# Altium project Prj_machcambienHall_v1.PrjPcb
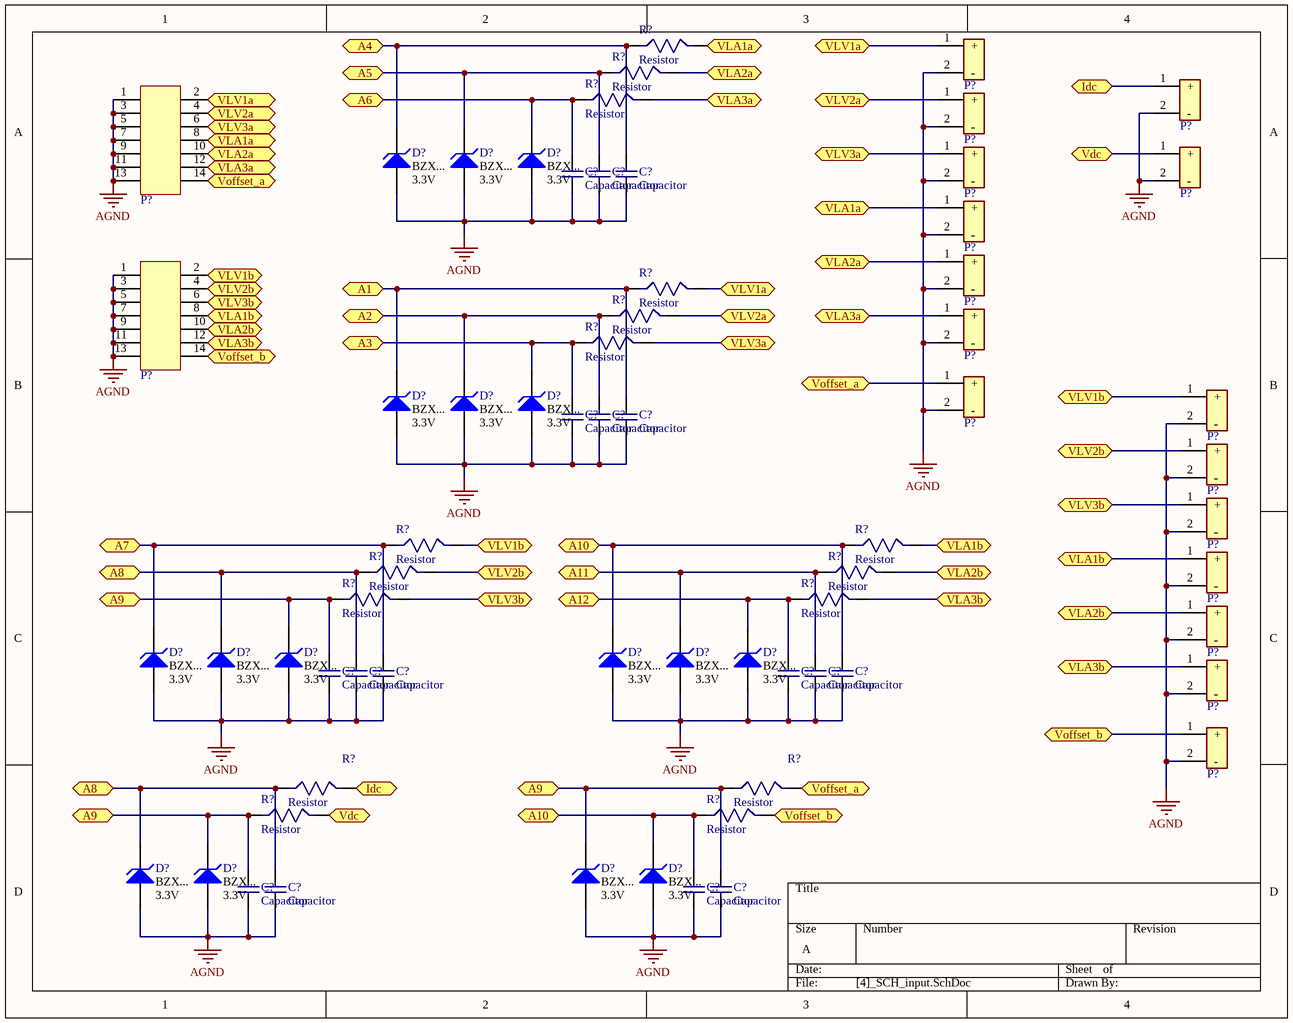
[diagram p0: [4]_SCH_input.SchDoc]
5 sheets, 283 parts. Net scope: flat (ports and power ports of the same name join across sheets).
Board files: PCB_machcambienHall.PcbDoc, PCB_mcbHallV2.PcbDoc, PCB_mcbHallV3.PcbDoc
Sheets:
  [4]_SCH_input.SchDoc
  SCH_power.SchDoc
  SCH_HallcurrentLA25p.SchDoc
  SCH_HallVoltageLV25np.SchDoc
  SCH_Output.SchDoc

## Sheet [4]_SCH_input.SchDoc
size A

### Parts
(Parts that share a designator on the sheet are numbered #1, #2 ... from top to bottom, then left to right.)
C?#1  Capacitor  [C-NP-0805]
C?#2  Capacitor  [C-NP-0805]
C?#3  Capacitor  [C-NP-0805]
C?#4  Capacitor  [C-NP-0805]
C?#5  Capacitor  [C-NP-0805]
C?#6  Capacitor  [C-NP-0805]
C?#7  Capacitor  [C-NP-0805]
C?#8  Capacitor  [C-NP-0805]
C?#9  Capacitor  [C-NP-0805]
C?#10  Capacitor  [C-NP-0805]
C?#11  Capacitor  [C-NP-0805]
C?#12  Capacitor  [C-NP-0805]
C?#13  Capacitor  [C-NP-0805]
C?#14  Capacitor  [C-NP-0805]
C?#15  Capacitor  [C-NP-0805]
C?#16  Capacitor  [C-NP-0805]
D?#1  value BZX...  Volt: 3.3V  [DO_123]  (hidden comment: Diode Zener)
D?#2  value BZX...  Volt: 3.3V  [DO_123]  (hidden comment: Diode Zener)
D?#3  value BZX...  Volt: 3.3V  [DO_123]  (hidden comment: Diode Zener)
D?#4  value BZX...  Volt: 3.3V  [DO_123]  (hidden comment: Diode Zener)
D?#5  value BZX...  Volt: 3.3V  [DO_123]  (hidden comment: Diode Zener)
D?#6  value BZX...  Volt: 3.3V  [DO_123]  (hidden comment: Diode Zener)
D?#7  value BZX...  Volt: 3.3V  [DO_123]  (hidden comment: Diode Zener)
D?#8  value BZX...  Volt: 3.3V  [DO_123]  (hidden comment: Diode Zener)
D?#9  value BZX...  Volt: 3.3V  [DO_123]  (hidden comment: Diode Zener)
D?#10  value BZX...  Volt: 3.3V  [DO_123]  (hidden comment: Diode Zener)
D?#11  value BZX...  Volt: 3.3V  [DO_123]  (hidden comment: Diode Zener)
D?#12  value BZX...  Volt: 3.3V  [DO_123]  (hidden comment: Diode Zener)
D?#13  value BZX...  Volt: 3.3V  [DO_123]  (hidden comment: Diode Zener)
D?#14  value BZX...  Volt: 3.3V  [DO_123]  (hidden comment: Diode Zener)
D?#15  value BZX...  Volt: 3.3V  [DO_123]  (hidden comment: Diode Zener)
D?#16  value BZX...  Volt: 3.3V  [DO_123]  (hidden comment: Diode Zener)
P?#1  SMA  [SMA]  (value not drawn)
P?#2  SMA  [SMA]  (value not drawn)
P?#3  header_2x7  [hd_2x7]  (value not drawn)
P?#4  SMA  [SMA]  (value not drawn)
P?#5  SMA  [SMA]  (value not drawn)
P?#6  SMA  [SMA]  (value not drawn)
P?#7  SMA  [SMA]  (value not drawn)
P?#8  SMA  [SMA]  (value not drawn)
P?#9  header_2x7  [hd_2x7]  (value not drawn)
P?#10  SMA  [SMA]  (value not drawn)
P?#11  SMA  [SMA]  (value not drawn)
P?#12  SMA  [SMA]  (value not drawn)
P?#13  SMA  [SMA]  (value not drawn)
P?#14  SMA  [SMA]  (value not drawn)
P?#15  SMA  [SMA]  (value not drawn)
P?#16  SMA  [SMA]  (value not drawn)
P?#17  SMA  [SMA]  (value not drawn)
P?#18  SMA  [SMA]  (value not drawn)
R?#1  Resistor  [RESC0805]
R?#2  Resistor  [RESC0805]
R?#3  Resistor  [RESC0805]
R?#4  Resistor  [RESC0805]
R?#5  Resistor  [RESC0805]
R?#6  Resistor  [RESC0805]
R?#7  Resistor  [RESC0805]
R?#8  Resistor  [RESC0805]
R?#9  Resistor  [RESC0805]
R?#10  Resistor  [RESC0805]
R?#11  Resistor  [RESC0805]
R?#12  Resistor  [RESC0805]
R?#13  Resistor  [RESC0805]
R?#14  Resistor  [RESC0805]
R?#15  Resistor  [RESC0805]
R?#16  Resistor  [RESC0805]

### Ports
A1, A2, A3, A4, A5, A6, A7, A8, A9, A10, A11, A12, Idc, Vdc, VLA1a, VLA1b, VLA2a, VLA2b, VLA3a, VLA3b, VLV1a, VLV1b, VLV2a, VLV2b, VLV3a, VLV3b, Voffset_a, Voffset_b

### Nets
AGND: C?#1.1 C?#2.1 C?#3.1 C?#4.1 C?#5.1 C?#6.1 C?#7.1 C?#8.1 C?#9.1 C?#10.1 C?#11.1 C?#12.1 C?#13.1 C?#14.1 C?#15.1 C?#16.1 D?#1.1(A) D?#2.1(A) D?#3.1(A) D?#4.1(A) D?#5.1(A) D?#6.1(A) D?#7.1(A) D?#8.1(A) D?#9.1(A) D?#10.1(A) D?#11.1(A) D?#12.1(A) D?#13.1(A) D?#14.1(A) D?#15.1(A) D?#16.1(A) P?#1.2(-) P?#2.2(-) P?#3.1 P?#3.3 P?#3.5 P?#3.7 P?#3.9 P?#3.11 P?#3.13 P?#4.2(-) P?#5.2(-) P?#6.2(-) P?#7.2(-) P?#8.2(-) P?#9.1 P?#9.3 P?#9.5 P?#9.7 P?#9.9 P?#9.11 P?#9.13 P?#10.2(-) P?#11.2(-) P?#12.2(-) P?#13.2(-) P?#14.2(-) P?#15.2(-) P?#16.2(-) P?#17.2(-) P?#18.2(-)
NetC?#1_2: C?#1.2 D?#3.2(K) R?#3.1 ; port A6
NetC?#2_2: C?#2.2 D?#2.2(K) R?#2.1 ; port A5
NetC?#3_2: C?#3.2 D?#1.2(K) R?#1.1 ; port A4
NetC?#4_2: C?#4.2 D?#6.2(K) R?#6.1 ; port A3
NetC?#5_2: C?#5.2 D?#5.2(K) R?#5.1 ; port A2
NetC?#6_2: C?#6.2 D?#4.2(K) R?#4.1 ; port A1
NetC?#7_2: C?#7.2 C?#13.2 C?#16.2 D?#9.2(K) D?#14.2(K) D?#15.2(K) R?#11.1 R?#14.1 R?#15.1 ; port A9
NetC?#8_2: C?#8.2 C?#14.2 D?#8.2(K) D?#13.2(K) R?#9.1 R?#13.1 ; port A8
NetC?#9_2: C?#9.2 D?#7.2(K) R?#7.1 ; port A7
NetC?#10_2: C?#10.2 D?#12.2(K) R?#12.1 ; port A12
NetC?#11_2: C?#11.2 D?#11.2(K) R?#10.1 ; port A11
NetC?#12_2: C?#12.2 C?#15.2 D?#10.2(K) D?#16.2(K) R?#8.1 R?#16.1 ; port A10
NetP?#1_1: P?#1.1(+) P?#3.2 R?#4.2 ; port VLV1a
NetP?#2_1: P?#2.1(+) R?#13.2 ; port Idc
NetP?#3_4: P?#3.4 P?#4.1(+) R?#5.2 ; port VLV2a
NetP?#3_6: P?#3.6 P?#5.1(+) R?#6.2 ; port VLV3a
NetP?#3_8: P?#3.8 P?#7.1(+) R?#1.2 ; port VLA1a
NetP?#3_10: P?#3.10 P?#8.1(+) R?#2.2 ; port VLA2a
NetP?#3_12: P?#3.12 P?#10.1(+) R?#3.2 ; port VLA3a
NetP?#3_14: P?#3.14 P?#11.1(+) R?#14.2 ; port Voffset_a
NetP?#6_1: P?#6.1(+) R?#15.2 ; port Vdc
NetP?#9_2: P?#9.2 P?#12.1(+) R?#7.2 ; port VLV1b
NetP?#9_4: P?#9.4 P?#13.1(+) R?#9.2 ; port VLV2b
NetP?#9_6: P?#9.6 P?#14.1(+) R?#11.2 ; port VLV3b
NetP?#9_8: P?#9.8 P?#15.1(+) R?#8.2 ; port VLA1b
NetP?#9_10: P?#9.10 P?#16.1(+) R?#10.2 ; port VLA2b
NetP?#9_12: P?#9.12 P?#17.1(+) R?#12.2 ; port VLA3b
NetP?#9_14: P?#9.14 P?#18.1(+) R?#16.2 ; port Voffset_b

### Library data of the parts
C?#1-C?#16 = capacitor_non_polar: capacitor non polar
D?#1-D?#16 = Diode Zener: Zener Diode; Vendor: Digikey; Published: 8-Jun-2000; LatestRevisionDate: 17-Jul-2002; LatestRevisionNote: Re-released for DXP Platform.; PackageReference: DIODE-0.7; Publisher: Altium Limited; ComponentLink1Description: Digikey Part Link; ComponentLink2Description: Open Datasheet; ComponentLink2URL: H:\LIBRARY\LIBRARY.Datasheet\
P?#1 P?#2 P?#4-P?#8 P?#10-P?#18 = SMA 13,5
P?#3 P?#9 = header_2x7pin

## Sheet SCH_power.SchDoc
size A; DocumentNumber: 1; SheetNumber: 1; SheetTotal: 4
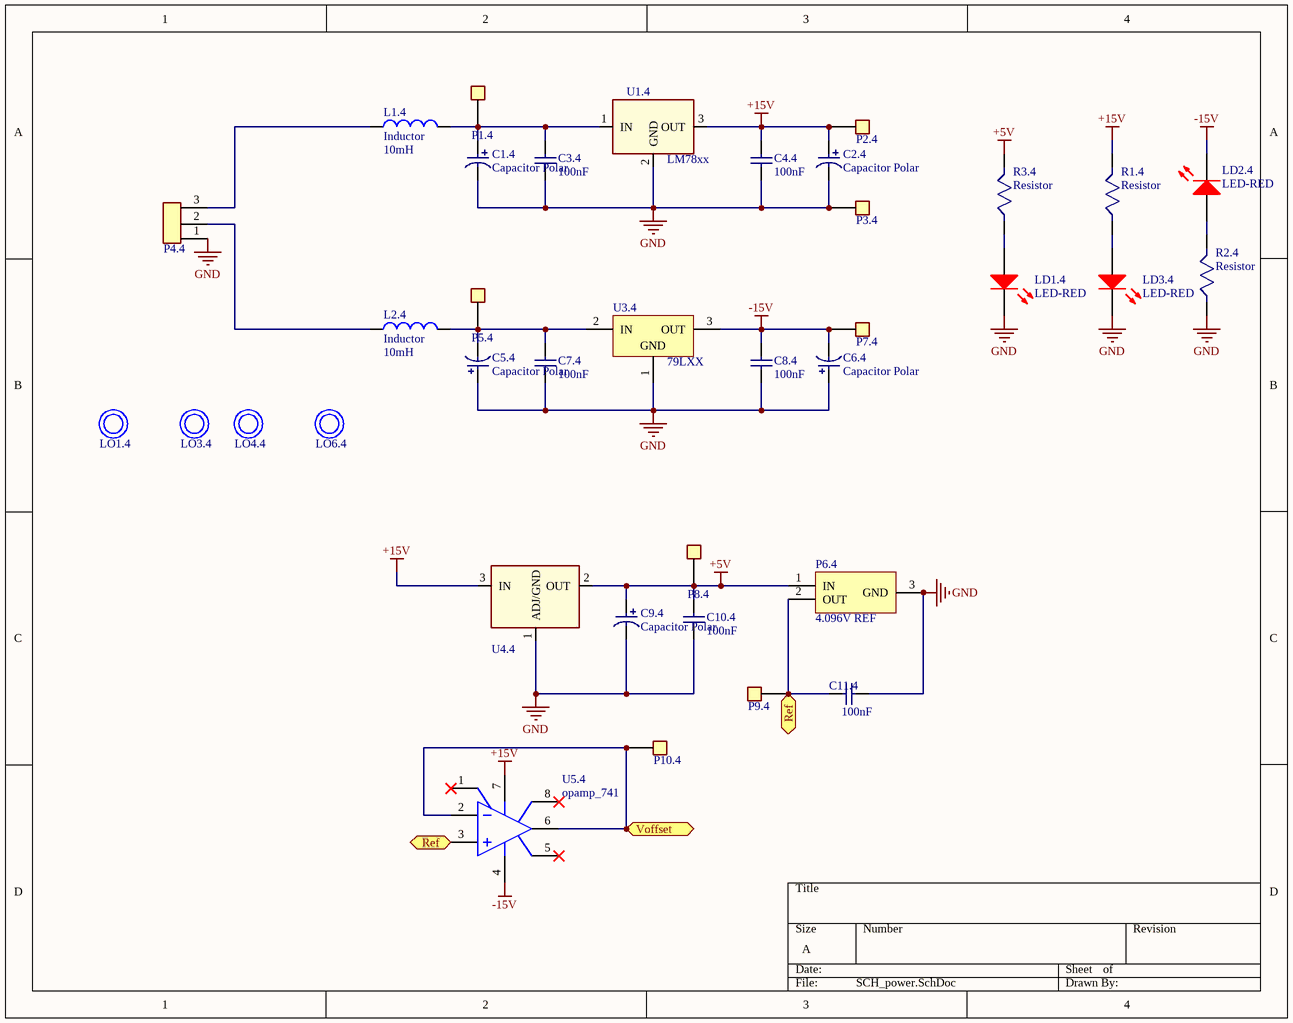
[diagram p1: SCH_power.SchDoc]

### Parts
C1.4  Capacitor Polar  [CAP_SMD_L=10.5]
C2.4  Capacitor Polar  [CAP_SMD_L=10.5]
C3.4  100nF  [C-NP-0805]
C4.4  100nF  [C-NP-0805]
C5.4  Capacitor Polar  [CAP_SMD_L=10.5]
C6.4  Capacitor Polar  [CAP_SMD_L=10.5]
C7.4  100nF  [C-NP-0805]
C8.4  100nF  [C-NP-0805]
C9.4  Capacitor Polar  [CAP_SMD_L=10.5]
C10.4  100nF  [C-NP-0805]
C11.4  100nF  [C-NP-0805]
L1.4  Inductor  value 10mH  [induction_coil]
L2.4  Inductor  value 10mH  [induction_coil]
LD1.4  LED-RED  [SMD 1206 RED]
LD2.4  LED-RED  [SMD 1206 RED]
LD3.4  LED-RED  [SMD 1206 RED]
LO1.4  LO KHOAN  [SP PCB]  (value not drawn)
LO3.4  LO KHOAN  [SP PCB]  (value not drawn)
LO4.4  LO KHOAN  [SP PCB]  (value not drawn)
LO6.4  LO KHOAN  [SP PCB]  (value not drawn)
P1.4  testpin  [tp_red_1p]  (value not drawn)
P2.4  testpin  [tp_red_1p]  (value not drawn)
P3.4  testpin  [Tp_black_1p]  (value not drawn)
P4.4  domino_3p  [domino_3p]  (value not drawn)
P5.4  testpin  [tp_red_1p]  (value not drawn)
P6.4  4.096V REF  [SOT233]
P7.4  testpin  [tp_red_1p]  (value not drawn)
P8.4  testpin  [tp_red_1p]  (value not drawn)
P9.4  testpin  [tp_red_1p]  (value not drawn)
P10.4  testpin  [tp_red_1p]  (value not drawn)
R1.4  Resistor  [RESC0805]
R2.4  Resistor  [RESC0805]
R3.4  Resistor  [RESC0805]
U1.4  LM78xx  [TO 220 THermal 25x25]
U3.4  79LXX  [TO 220 THermal 25x25]
U4.4  LM1117MP-3.3TR  [AMS1117]  (value not drawn)
U5.4  opamp_741  [SOIC-8_dan]

### Ports
Ref, Voffset

### Nets
+5V: C9.4.1 C10.4.1 P6.4.1(IN) P8.4.1 R3.4.2 U4.4.2(OUT)
+15V: C2.4.1 C4.4.1 P2.4.1 R1.4.2 U1.4.3(OUT) U4.4.3(IN) U5.4.7(V+)
-15V: C6.4.2 C8.4.1 LD2.4.2(K) P7.4.1 U3.4.3(OUT) U5.4.4(V-)
GND: C1.4.2 C2.4.2 C3.4.2 C4.4.2 C5.4.1 C6.4.1 C7.4.2 C8.4.2 C9.4.2 C10.4.2 C11.4.1 LD1.4.2(K) LD3.4.2(K) P3.4.1 P4.4.1 P6.4.3(GND) R2.4.1 U1.4.2(GND) U3.4.1(GND) U4.4.1(ADJ/GND)
NetC1.4_1: C1.4.1 C3.4.1 L1.4.2 P1.4.1 U1.4.1(IN)
NetC5.4_2: C5.4.2 C7.4.1 L2.4.2 P5.4.1 U3.4.2(IN)
NetC11.4_2: C11.4.2 P6.4.2(OUT) P9.4.1 U5.4.3(IN+) ; port Ref
NetL1.4_1: L1.4.1 P4.4.3
NetL2.4_1: L2.4.1 P4.4.2
NetLD1.4_1: LD1.4.1(A) R3.4.1
NetLD2.4_1: LD2.4.1(A) R2.4.2
NetLD3.4_1: LD3.4.1(A) R1.4.1
NetP2.3_13: P10.4.1 U5.4.2(IN-) U5.4.6(OUT) ; port Voffset

Not connected (* = marked no-connect by the designer): U5.4 1(VOSTRIM)* 5(NC)* 8(VOSTRIM)*

### Library data of the parts
C1.4 C2.4 C5.4 C6.4 C9.4 = capacitor_polar 6.3x11mm
C3.4 C4.4 C7.4 C8.4 C10.4 C11.4 = capacitor_non_polar: capacitor non polar
L1.4 L2.4 = Inductor: Code_IEC: 1005; Published: 8-Jun-2000; LatestRevisionDate: 29-May-2009; LatestRevisionNote: IPC-7351 Footprint Added.; PackageReference: 0402-A; Publisher: Altium Limited; PackageDescription: Chip Inductor; Code_JEITA: 0402
LD1.4 LD2.4 LD3.4 = LED_LTST-C191KRKT: LED RED CLEAR 0603 SMD; Manufacturer: Lite-On Inc.; Lens Color: Colorless; Millicandela Rating: 54mcd; Lens Style/Size: Rectangle with Flat Top, 1.10mm x 0.80mm; Voltage - Forward (Vf) (Typ): 2V; Current - Test: 20mA; Viewing Angle: 130°; Wavelength - Dominant: 631nm; Wavelength - Peak: 639nm; Supplier 1: Digi-Key; Manufacturer Part Number: LTST-C191KRKT; RoHS: RoHS Compliant; Category: Optoelectronics; Stock 1: 711347; Pricing 1: 1=0.29, 10=0.211, 25=0.1556, 100=0.1111, 250=0.07556, 500=0.06666, 1000=0.05222, 2500=0.05111 (USD); Packaging: Digi-Reel®; Part Status: Active; Color: Red; Lens Transparency: Clear; Mounting Type: Surface Mount; Features: -; Size / Dimension: 1.60mm L x 0.80mm W; Height (Max): 0.65mm; ComponentLink1URL: http://optoelectronics.liteon.com/upload/download/DS22-2000-223/LTST-C191KRKT.PDF; ComponentLink1Description: http://optoelectronics.liteon.com/upload/download/DS22-2000-223/LTST-C191KRKT.PDF; Supplier Part Number 1: 160-1447-6-ND; Package / Case: 0603 (1608 Metric)
P6.4 = MCP1541T
U1.4 = LM78xx: Regulator; Manufacturer: Fairchild Semiconductor Corporation; PSpiceTemplate: X^@REFDES %IN %OUT %GND @MODEL; Vendor: Digikey; Output Current: Up to 1A; V out: 5V; Tolerance: 4 %; Value: LM7805CT; Published: 13-April-2009; Publisher: Hoang Nguyen; ComponentLink1Description: Digikey Part Link; ComponentLink2Description: Open Datasheet; ComponentLink2URL: H:\LIBRARY\LIBRARY.Datasheet\LM7805.pdf; Price: 2500 VND
U3.4 = LM79LXX: 3-Terminal Negative Regulator; Published: 15-Apr-2002; DatasheetVersion: Jul-1999; PackageVersion: 2000; PackageReference: Z03A; Publisher: Altium Limited; PackageDescription: TO, Flat Index; 3 In-Line, Axial Leads; Body Dia. 4.6mm; Leads 0.53 x 0.39 mm (max); ComponentLink1Description: Manufacturer Link; ComponentLink1URL: http://www.national.com/; ComponentLink2Description: Datasheet; ComponentLink2URL: http://www.national.com/ds.cgi/LM/LM320L.pdf; ComponentLink3Description: URL Link1; ComponentLink3URL: http://www.national.com/pf/LM/LM79L05.html
U4.4 = LM1117MP-3.3TR: 3.3V 800mA Low-Dropout Linear Regulator; PSpiceTemplate: X^@REFDES %IN %OUT %GND @MODEL; Vendor: Digikey; Volt (Max): 20V; Publisher: Hoang Nguyen; ComponentLink1URL: http://search.digikey.com/scripts/DkSearch/dksus.dll?Detail&name=LM1117MP-3.3TR-ND; ComponentLink1Description: Digikey Part Link; ComponentLink2Description: Open Datasheet; ComponentLink2URL: H:\LIBRARY\LIBRARY.Datasheet\LM1117.pdf; Published: 13-April-2009; V out: 3.3V; Output Current (max): 800mA; Price: 4.000 VND
U5.4 = opamp 741

## Sheet SCH_HallcurrentLA25p.SchDoc
size A; DocumentNumber: 2; SheetNumber: 2; SheetTotal: 4
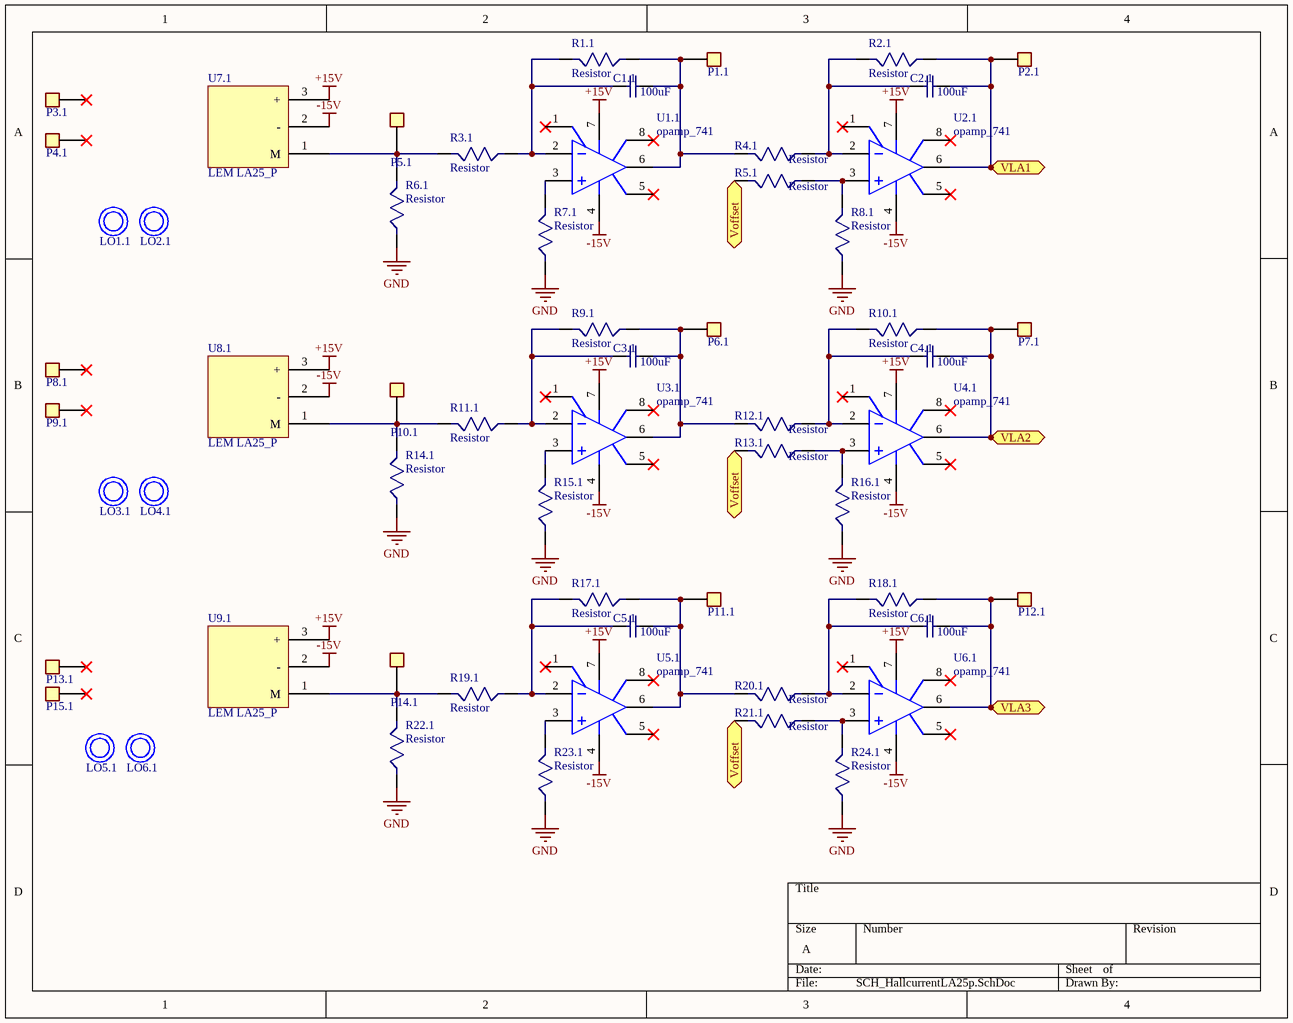
[diagram p2: SCH_HallcurrentLA25p.SchDoc]

### Parts
C1.1  100uF  [CAPC0805]
C2.1  100uF  [CAPC0805]
C3.1  100uF  [CAPC0805]
C4.1  100uF  [CAPC0805]
C5.1  100uF  [CAPC0805]
C6.1  100uF  [CAPC0805]
LO1.1  LO KHOAN  [Lo Khoang - 6mm]  (value not drawn)
LO2.1  LO KHOAN  [Lo Khoang - 6mm]  (value not drawn)
LO3.1  LO KHOAN  [Lo Khoang - 6mm]  (value not drawn)
LO4.1  LO KHOAN  [Lo Khoang - 6mm]  (value not drawn)
LO5.1  LO KHOAN  [Lo Khoang - 6mm]  (value not drawn)
LO6.1  LO KHOAN  [Lo Khoang - 6mm]  (value not drawn)
P1.1  testpin  [Tp_blue_1p]  (value not drawn)
P2.1  testpin  [Tp_blue_1p]  (value not drawn)
P3.1  Terminal on PCB  [Terminal M5]  (value not drawn)
P4.1  Terminal on PCB  [Terminal M5]  (value not drawn)
P5.1  testpin  [Tp_blue_1p]  (value not drawn)
P6.1  testpin  [Tp_blue_1p]  (value not drawn)
P7.1  testpin  [Tp_blue_1p]  (value not drawn)
P8.1  Terminal on PCB  [Terminal M5]  (value not drawn)
P9.1  Terminal on PCB  [Terminal M5]  (value not drawn)
P10.1  testpin  [Tp_blue_1p]  (value not drawn)
P11.1  testpin  [Tp_blue_1p]  (value not drawn)
P12.1  testpin  [Tp_blue_1p]  (value not drawn)
P13.1  Terminal on PCB  [Terminal M5]  (value not drawn)
P14.1  testpin  [Tp_blue_1p]  (value not drawn)
P15.1  Terminal on PCB  [Terminal M5]  (value not drawn)
R1.1  Resistor  [RESC0805]
R2.1  Resistor  [RESC0805]
R3.1  Resistor  [RESC0805]
R4.1  Resistor  [RESC0805]
R5.1  Resistor  [RESC0805]
R6.1  Resistor  [RESC0805]
R7.1  Resistor  [RESC0805]
R8.1  Resistor  [RESC0805]
R9.1  Resistor  [RESC0805]
R10.1  Resistor  [RESC0805]
R11.1  Resistor  [RESC0805]
R12.1  Resistor  [RESC0805]
R13.1  Resistor  [RESC0805]
R14.1  Resistor  [RESC0805]
R15.1  Resistor  [RESC0805]
R16.1  Resistor  [RESC0805]
R17.1  Resistor  [RESC0805]
R18.1  Resistor  [RESC0805]
R19.1  Resistor  [RESC0805]
R20.1  Resistor  [RESC0805]
R21.1  Resistor  [RESC0805]
R22.1  Resistor  [RESC0805]
R23.1  Resistor  [RESC0805]
R24.1  Resistor  [RESC0805]
U1.1  opamp_741  [SOIC-8_dan]
U2.1  opamp_741  [SOIC-8_dan]
U3.1  opamp_741  [SOIC-8_dan]
U4.1  opamp_741  [SOIC-8_dan]
U5.1  opamp_741  [SOIC-8_dan]
U6.1  opamp_741  [SOIC-8_dan]
U7.1  LEM LA25_P  [LEM LA25_P]
U8.1  LEM LA25_P  [LEM LA25_P]
U9.1  LEM LA25_P  [LEM LA25_P]

### Ports
VLA1, VLA2, VLA3, Voffset

### Nets
+15V: U1.1.7(V+) U2.1.7(V+) U3.1.7(V+) U4.1.7(V+) U5.1.7(V+) U6.1.7(V+) U7.1.3(+) U8.1.3(+) U9.1.3(+)
-15V: U1.1.4(V-) U2.1.4(V-) U3.1.4(V-) U4.1.4(V-) U5.1.4(V-) U6.1.4(V-) U7.1.2(-) U8.1.2(-) U9.1.2(-)
GND: R6.1.1 R7.1.1 R8.1.1 R14.1.1 R15.1.1 R16.1.1 R22.1.1 R23.1.1 R24.1.1
NetC1.1_1: C1.1.1 R1.1.2 R3.1.1 U1.1.2(IN-)
NetC1.1_2: C1.1.2 P1.1.1 R1.1.1 R4.1.2 U1.1.6(OUT)
NetC2.1_1: C2.1.1 R2.1.2 R4.1.1 U2.1.2(IN-)
NetC2.1_2: C2.1.2 P2.1.1 R2.1.1 U2.1.6(OUT) ; port VLA1
NetC3.1_1: C3.1.1 R9.1.2 R11.1.1 U3.1.2(IN-)
NetC3.1_2: C3.1.2 P6.1.1 R9.1.1 R12.1.2 U3.1.6(OUT)
NetC4.1_1: C4.1.1 R10.1.2 R12.1.1 U4.1.2(IN-)
NetC4.1_2: C4.1.2 P7.1.1 R10.1.1 U4.1.6(OUT) ; port VLA2
NetC5.1_1: C5.1.1 R17.1.2 R19.1.1 U5.1.2(IN-)
NetC5.1_2: C5.1.2 P11.1.1 R17.1.1 R20.1.2 U5.1.6(OUT)
NetC6.1_1: C6.1.1 R18.1.2 R20.1.1 U6.1.2(IN-)
NetC6.1_2: C6.1.2 P12.1.1 R18.1.1 U6.1.6(OUT) ; port VLA3
NetP2.3_13: R5.1.2 R13.1.2 R21.1.2 ; port Voffset
NetP5.1_1: P5.1.1 R3.1.2 R6.1.2 U7.1.1(M)
NetP10.1_1: P10.1.1 R11.1.2 R14.1.2 U8.1.1(M)
NetP14.1_1: P14.1.1 R19.1.2 R22.1.2 U9.1.1(M)
NetR5.1_1: R5.1.1 R8.1.2 U2.1.3(IN+)
NetR7.1_2: R7.1.2 U1.1.3(IN+)
NetR13.1_1: R13.1.1 R16.1.2 U4.1.3(IN+)
NetR15.1_2: R15.1.2 U3.1.3(IN+)
NetR21.1_1: R21.1.1 R24.1.2 U6.1.3(IN+)
NetR23.1_2: R23.1.2 U5.1.3(IN+)

Not connected (* = marked no-connect by the designer): P3.1 1*; P4.1 1*; P8.1 1*; P9.1 1*; P13.1 1*; P15.1 1*; U1.1 1(VOSTRIM)* 5(NC)* 8(VOSTRIM)*; U2.1 1(VOSTRIM)* 5(NC)* 8(VOSTRIM)*; U3.1 1(VOSTRIM)* 5(NC)* 8(VOSTRIM)*; U4.1 1(VOSTRIM)* 5(NC)* 8(VOSTRIM)*; U5.1 1(VOSTRIM)* 5(NC)* 8(VOSTRIM)*; U6.1 1(VOSTRIM)* 5(NC)* 8(VOSTRIM)*

### Library data of the parts
C1.1 C2.1 C3.1 C4.1 C5.1 C6.1 = capacitor_non_polar: capacitor non polar
U1.1 U2.1 U3.1 U4.1 U5.1 U6.1 = opamp 741

## Sheet SCH_HallVoltageLV25np.SchDoc
size A; DocumentNumber: 3; SheetNumber: 3; SheetTotal: 4
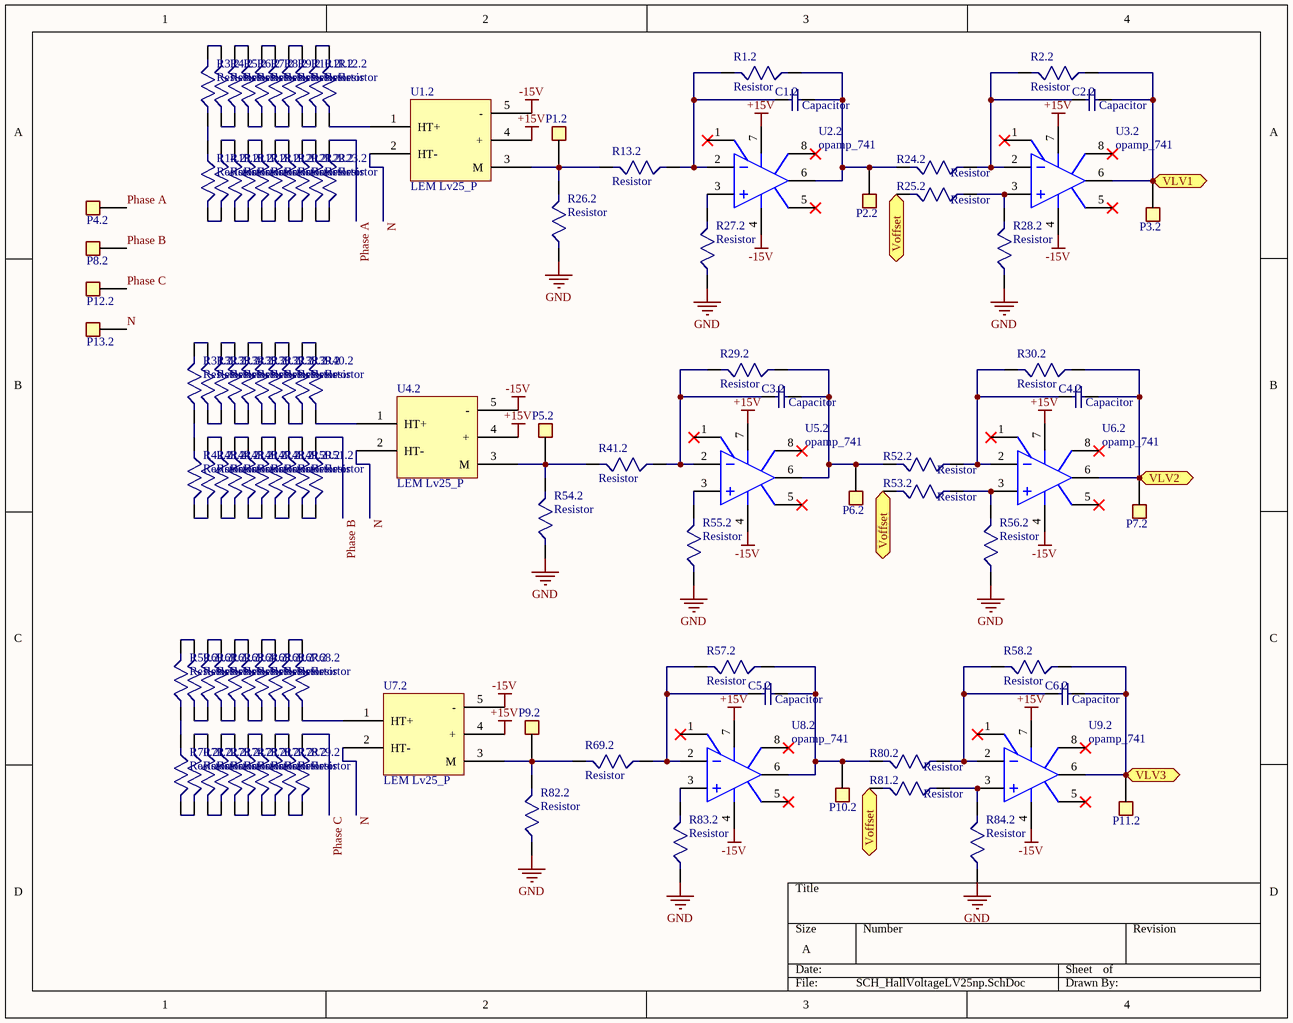
[diagram p3: SCH_HallVoltageLV25np.SchDoc]

### Parts
C1.2  Capacitor  [CAPC0805]
C2.2  Capacitor  [CAPC0805]
C3.2  Capacitor  [CAPC0805]
C4.2  Capacitor  [CAPC0805]
C5.2  Capacitor  [CAPC0805]
C6.2  Capacitor  [CAPC0805]
P1.2  testpin  [tp_red_1p]  (value not drawn)
P2.2  testpin  [tp_red_1p]  (value not drawn)
P3.2  testpin  [tp_red_1p]  (value not drawn)
P4.2  Terminal on PCB  [Terminal M5]  (value not drawn)
P5.2  testpin  [tp_red_1p]  (value not drawn)
P6.2  testpin  [tp_red_1p]  (value not drawn)
P7.2  testpin  [tp_red_1p]  (value not drawn)
P8.2  Terminal on PCB  [Terminal M5]  (value not drawn)
P9.2  testpin  [tp_red_1p]  (value not drawn)
P10.2  testpin  [tp_red_1p]  (value not drawn)
P11.2  testpin  [tp_red_1p]  (value not drawn)
P12.2  Terminal on PCB  [Terminal M5]  (value not drawn)
P13.2  Terminal on PCB  [Terminal M5]  (value not drawn)
R1.2  Resistor  [RESC0805]
R2.2  Resistor  [RESC0805]
R3.2  Resistor  [RESC0805]
R4.2  Resistor  [RESC0805]
R5.2  Resistor  [RESC0805]
R6.2  Resistor  [RESC0805]
R7.2  Resistor  [RESC0805]
R8.2  Resistor  [RESC0805]
R9.2  Resistor  [RESC0805]
R10.2  Resistor  [RESC0805]
R11.2  Resistor  [RESC0805]
R12.2  Resistor  [RESC0805]
R13.2  Resistor  [RESC0805]
R14.2  Resistor  [RESC0805]
R15.2  Resistor  [RESC0805]
R16.2  Resistor  [RESC0805]
R17.2  Resistor  [RESC0805]
R18.2  Resistor  [RESC0805]
R19.2  Resistor  [RESC0805]
R20.2  Resistor  [RESC0805]
R21.2  Resistor  [RESC0805]
R22.2  Resistor  [RESC0805]
R23.2  Resistor  [RESC0805]
R24.2  Resistor  [RESC0805]
R25.2  Resistor  [RESC0805]
R26.2  Resistor  [RESC0805]
R27.2  Resistor  [RESC0805]
R28.2  Resistor  [RESC0805]
R29.2  Resistor  [RESC0805]
R30.2  Resistor  [RESC0805]
R31.2  Resistor  [RESC0805]
R32.2  Resistor  [RESC0805]
R33.2  Resistor  [RESC0805]
R34.2  Resistor  [RESC0805]
R35.2  Resistor  [RESC0805]
R36.2  Resistor  [RESC0805]
R37.2  Resistor  [RESC0805]
R38.2  Resistor  [RESC0805]
R39.2  Resistor  [RESC0805]
R40.2  Resistor  [RESC0805]
R41.2  Resistor  [RESC0805]
R42.2  Resistor  [RESC0805]
R43.2  Resistor  [RESC0805]
R44.2  Resistor  [RESC0805]
R45.2  Resistor  [RESC0805]
R46.2  Resistor  [RESC0805]
R47.2  Resistor  [RESC0805]
R48.2  Resistor  [RESC0805]
R49.2  Resistor  [RESC0805]
R50.2  Resistor  [RESC0805]
R51.2  Resistor  [RESC0805]
R52.2  Resistor  [RESC0805]
R53.2  Resistor  [RESC0805]
R54.2  Resistor  [RESC0805]
R55.2  Resistor  [RESC0805]
R56.2  Resistor  [RESC0805]
R57.2  Resistor  [RESC0805]
R58.2  Resistor  [RESC0805]
R59.2  Resistor  [RESC0805]
R60.2  Resistor  [RESC0805]
R61.2  Resistor  [RESC0805]
R62.2  Resistor  [RESC0805]
R63.2  Resistor  [RESC0805]
R64.2  Resistor  [RESC0805]
R65.2  Resistor  [RESC0805]
R66.2  Resistor  [RESC0805]
R67.2  Resistor  [RESC0805]
R68.2  Resistor  [RESC0805]
R69.2  Resistor  [RESC0805]
R70.2  Resistor  [RESC0805]
R71.2  Resistor  [RESC0805]
R72.2  Resistor  [RESC0805]
R73.2  Resistor  [RESC0805]
R74.2  Resistor  [RESC0805]
R75.2  Resistor  [RESC0805]
R76.2  Resistor  [RESC0805]
R77.2  Resistor  [RESC0805]
R78.2  Resistor  [RESC0805]
R79.2  Resistor  [RESC0805]
R80.2  Resistor  [RESC0805]
R81.2  Resistor  [RESC0805]
R82.2  Resistor  [RESC0805]
R83.2  Resistor  [RESC0805]
R84.2  Resistor  [RESC0805]
U1.2  LEM Lv25_P  [LEN LV25_P]
U2.2  opamp_741  [SOIC-8_dan]
U3.2  opamp_741  [SOIC-8_dan]
U4.2  LEM Lv25_P  [LEN LV25_P]
U5.2  opamp_741  [SOIC-8_dan]
U6.2  opamp_741  [SOIC-8_dan]
U7.2  LEM Lv25_P  [LEN LV25_P]
U8.2  opamp_741  [SOIC-8_dan]
U9.2  opamp_741  [SOIC-8_dan]

### Ports
VLV1, VLV2, VLV3, Voffset

### Nets
+15V: U1.2.4(+) U2.2.7(V+) U3.2.7(V+) U4.2.4(+) U5.2.7(V+) U6.2.7(V+) U7.2.4(+) U8.2.7(V+) U9.2.7(V+)
-15V: U1.2.5(-) U2.2.4(V-) U3.2.4(V-) U4.2.5(-) U5.2.4(V-) U6.2.4(V-) U7.2.5(-) U8.2.4(V-) U9.2.4(V-)
GND: R26.2.1 R27.2.1 R28.2.1 R54.2.1 R55.2.1 R56.2.1 R82.2.1 R83.2.1 R84.2.1
N: P13.2.1 U1.2.2(HT-) U4.2.2(HT-) U7.2.2(HT-)
Phase A: P4.2.1 R23.2.1
Phase B: P8.2.1 R51.2.1
Phase C: P12.2.1 R79.2.1
NetC1.2_1: C1.2.1 R1.2.2 R13.2.1 U2.2.2(IN-)
NetC1.2_2: C1.2.2 P2.2.1 R1.2.1 R24.2.2 U2.2.6(OUT)
NetC2.2_1: C2.2.1 R2.2.2 R24.2.1 U3.2.2(IN-)
NetC2.2_2: C2.2.2 P3.2.1 R2.2.1 U3.2.6(OUT) ; port VLV1
NetC3.2_1: C3.2.1 R29.2.2 R41.2.1 U5.2.2(IN-)
NetC3.2_2: C3.2.2 P6.2.1 R29.2.1 R52.2.2 U5.2.6(OUT)
NetC4.2_1: C4.2.1 R30.2.2 R52.2.1 U6.2.2(IN-)
NetC4.2_2: C4.2.2 P7.2.1 R30.2.1 U6.2.6(OUT) ; port VLV2
NetC5.2_1: C5.2.1 R57.2.2 R69.2.1 U8.2.2(IN-)
NetC5.2_2: C5.2.2 P10.2.1 R57.2.1 R80.2.2 U8.2.6(OUT)
NetC6.2_1: C6.2.1 R58.2.2 R80.2.1 U9.2.2(IN-)
NetC6.2_2: C6.2.2 P11.2.1 R58.2.1 U9.2.6(OUT) ; port VLV3
NetP1.2_1: P1.2.1 R13.2.2 R26.2.2 U1.2.3(M)
NetP2.3_13: R25.2.2 R53.2.2 R81.2.2 ; port Voffset
NetP5.2_1: P5.2.1 R41.2.2 R54.2.2 U4.2.3(M)
NetP9.2_1: P9.2.1 R69.2.2 R82.2.2 U7.2.3(M)
NetR3.2_1: R3.2.1 R14.2.1
NetR3.2_2: R3.2.2 R4.2.2
NetR4.2_1: R4.2.1 R5.2.1
NetR5.2_2: R5.2.2 R6.2.2
NetR6.2_1: R6.2.1 R7.2.1
NetR7.2_2: R7.2.2 R8.2.2
NetR8.2_1: R8.2.1 R9.2.1
NetR9.2_2: R9.2.2 R10.2.2
NetR10.2_1: R10.2.1 R11.2.1
NetR11.2_2: R11.2.2 R12.2.2
NetR12.2_1: R12.2.1 U1.2.1(HT+)
NetR14.2_2: R14.2.2 R15.2.2
NetR15.2_1: R15.2.1 R16.2.1
NetR16.2_2: R16.2.2 R17.2.2
NetR17.2_1: R17.2.1 R18.2.1
NetR18.2_2: R18.2.2 R19.2.2
NetR19.2_1: R19.2.1 R20.2.1
NetR20.2_2: R20.2.2 R21.2.2
NetR21.2_1: R21.2.1 R22.2.1
NetR22.2_2: R22.2.2 R23.2.2
NetR25.2_1: R25.2.1 R28.2.2 U3.2.3(IN+)
NetR27.2_2: R27.2.2 U2.2.3(IN+)
NetR31.2_1: R31.2.1 R42.2.1
NetR31.2_2: R31.2.2 R32.2.2
NetR32.2_1: R32.2.1 R33.2.1
NetR33.2_2: R33.2.2 R34.2.2
NetR34.2_1: R34.2.1 R35.2.1
NetR35.2_2: R35.2.2 R36.2.2
NetR36.2_1: R36.2.1 R37.2.1
NetR37.2_2: R37.2.2 R38.2.2
NetR38.2_1: R38.2.1 R39.2.1
NetR39.2_2: R39.2.2 R40.2.2
NetR40.2_1: R40.2.1 U4.2.1(HT+)
NetR42.2_2: R42.2.2 R43.2.2
NetR43.2_1: R43.2.1 R44.2.1
NetR44.2_2: R44.2.2 R45.2.2
NetR45.2_1: R45.2.1 R46.2.1
NetR46.2_2: R46.2.2 R47.2.2
NetR47.2_1: R47.2.1 R48.2.1
NetR48.2_2: R48.2.2 R49.2.2
NetR49.2_1: R49.2.1 R50.2.1
NetR50.2_2: R50.2.2 R51.2.2
NetR53.2_1: R53.2.1 R56.2.2 U6.2.3(IN+)
NetR55.2_2: R55.2.2 U5.2.3(IN+)
NetR59.2_1: R59.2.1 R70.2.1
NetR59.2_2: R59.2.2 R60.2.2
NetR60.2_1: R60.2.1 R61.2.1
NetR61.2_2: R61.2.2 R62.2.2
NetR62.2_1: R62.2.1 R63.2.1
NetR63.2_2: R63.2.2 R64.2.2
NetR64.2_1: R64.2.1 R65.2.1
NetR65.2_2: R65.2.2 R66.2.2
NetR66.2_1: R66.2.1 R67.2.1
NetR67.2_2: R67.2.2 R68.2.2
NetR68.2_1: R68.2.1 U7.2.1(HT+)
NetR70.2_2: R70.2.2 R71.2.2
NetR71.2_1: R71.2.1 R72.2.1
NetR72.2_2: R72.2.2 R73.2.2
NetR73.2_1: R73.2.1 R74.2.1
NetR74.2_2: R74.2.2 R75.2.2
NetR75.2_1: R75.2.1 R76.2.1
NetR76.2_2: R76.2.2 R77.2.2
NetR77.2_1: R77.2.1 R78.2.1
NetR78.2_2: R78.2.2 R79.2.2
NetR81.2_1: R81.2.1 R84.2.2 U9.2.3(IN+)
NetR83.2_2: R83.2.2 U8.2.3(IN+)

Not connected (* = marked no-connect by the designer): U2.2 1(VOSTRIM)* 5(NC)* 8(VOSTRIM)*; U3.2 1(VOSTRIM)* 5(NC)* 8(VOSTRIM)*; U5.2 1(VOSTRIM)* 5(NC)* 8(VOSTRIM)*; U6.2 1(VOSTRIM)* 5(NC)* 8(VOSTRIM)*; U8.2 1(VOSTRIM)* 5(NC)* 8(VOSTRIM)*; U9.2 1(VOSTRIM)* 5(NC)* 8(VOSTRIM)*

### Library data of the parts
C1.2 C2.2 C3.2 C4.2 C5.2 C6.2 = capacitor_non_polar: capacitor non polar
U2.2 U3.2 U5.2 U6.2 U8.2 U9.2 = opamp 741

## Sheet SCH_Output.SchDoc
size A; DocumentNumber: 4; SheetNumber: 4; SheetTotal: 4
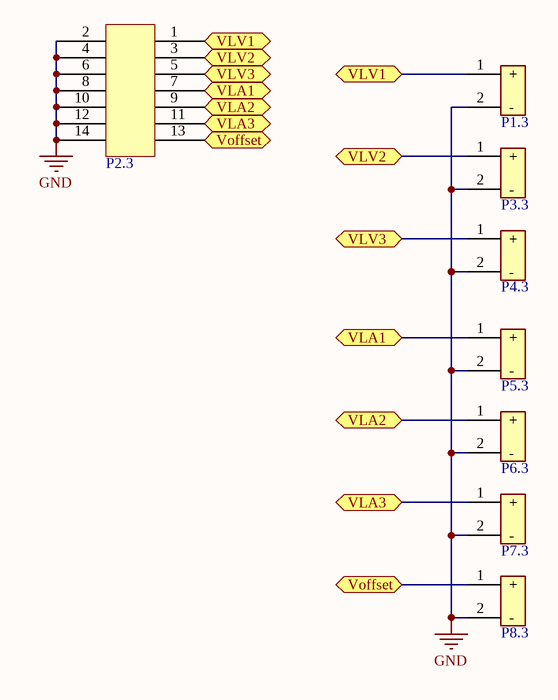
[diagram p4: SCH_Output.SchDoc]

### Parts
P1.3  SMA  [SMA]  (value not drawn)
P2.3  header_2x7  [hd_2x7]  (value not drawn)
P3.3  SMA  [SMA]  (value not drawn)
P4.3  SMA  [SMA]  (value not drawn)
P5.3  SMA  [SMA]  (value not drawn)
P6.3  SMA  [SMA]  (value not drawn)
P7.3  SMA  [SMA]  (value not drawn)
P8.3  SMA  [SMA]  (value not drawn)

### Ports
VLA1, VLA2, VLA3, VLV1, VLV2, VLV3, Voffset

### Nets
GND: P1.3.2(-) P2.3.2 P2.3.4 P2.3.6 P2.3.8 P2.3.10 P2.3.12 P2.3.14 P3.3.2(-) P4.3.2(-) P5.3.2(-) P6.3.2(-) P7.3.2(-) P8.3.2(-)
NetC2.1_2: P2.3.7 P5.3.1(+) ; port VLA1
NetC2.2_2: P1.3.1(+) P2.3.1 ; port VLV1
NetC4.1_2: P2.3.9 P6.3.1(+) ; port VLA2
NetC4.2_2: P2.3.3 P3.3.1(+) ; port VLV2
NetC6.1_2: P2.3.11 P7.3.1(+) ; port VLA3
NetC6.2_2: P2.3.5 P4.3.1(+) ; port VLV3
NetP2.3_13: P2.3.13 P8.3.1(+) ; port Voffset

### Library data of the parts
P1.3 P3.3 P4.3 P5.3 P6.3 P7.3 P8.3 = SMA 13,5
P2.3 = header_2x7pin

## Nets that join several sheets
+15V: SCH_power (7 pins), SCH_HallcurrentLA25p (9 pins), SCH_HallVoltageLV25np (9 pins)
-15V: SCH_power (6 pins), SCH_HallcurrentLA25p (9 pins), SCH_HallVoltageLV25np (9 pins)
GND: SCH_power (20 pins), SCH_HallcurrentLA25p (9 pins), SCH_HallVoltageLV25np (9 pins), SCH_Output (14 pins)
NetC2.1_2: SCH_HallcurrentLA25p (C2.1.2 P2.1.1 R2.1.1 U2.1.6), SCH_Output (P2.3.7 P5.3.1)
NetC2.2_2: SCH_HallVoltageLV25np (C2.2.2 P3.2.1 R2.2.1 U3.2.6), SCH_Output (P1.3.1 P2.3.1)
NetC4.1_2: SCH_HallcurrentLA25p (C4.1.2 P7.1.1 R10.1.1 U4.1.6), SCH_Output (P2.3.9 P6.3.1)
NetC4.2_2: SCH_HallVoltageLV25np (C4.2.2 P7.2.1 R30.2.1 U6.2.6), SCH_Output (P2.3.3 P3.3.1)
NetC6.1_2: SCH_HallcurrentLA25p (C6.1.2 P12.1.1 R18.1.1 U6.1.6), SCH_Output (P2.3.11 P7.3.1)
NetC6.2_2: SCH_HallVoltageLV25np (C6.2.2 P11.2.1 R58.2.1 U9.2.6), SCH_Output (P2.3.5 P4.3.1)
NetP2.3_13: SCH_power (P10.4.1 U5.4.2 U5.4.6), SCH_HallcurrentLA25p (R5.1.2 R13.1.2 R21.1.2), SCH_HallVoltageLV25np (R25.2.2 R53.2.2 R81.2.2), SCH_Output (P2.3.13 P8.3.1)